# Altium project MB1035.PrjPCB
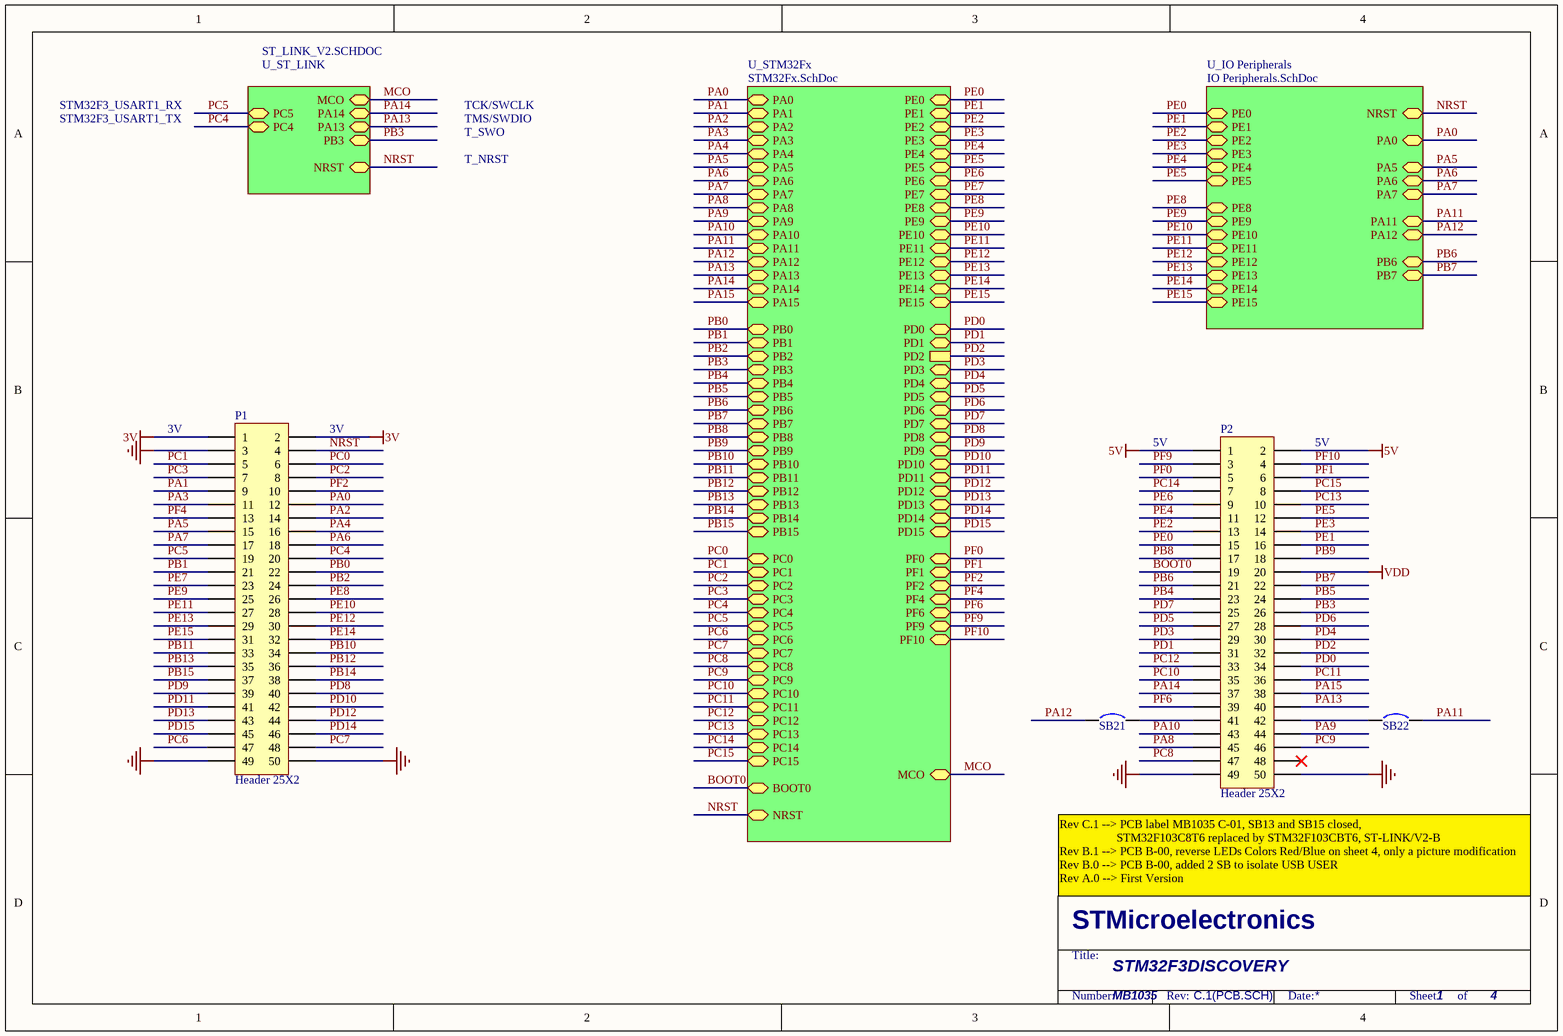
[diagram p0: MB1035.SchDoc]
4 sheets, 145 parts. Net scope: hierarchical (ports join the sheet entries above them; power ports are global).
Sheets:
  MB1035.SchDoc
    U_ST_LINK = ST_LINK_V2.SCHDOC
    U_IO Peripherals = IO Peripherals.SchDoc
    U_STM32Fx = STM32Fx.SchDoc

## Sheet MB1035.SchDoc
size A4; DocumentNumber: 1; Revision: C.1(PCB.SCH); SheetNumber: 1; SheetTotal: 4; PageSetup: Record=PageOptions|CenterHorizontal=True|CenterVertical=True|PrintScale=1.00|XCorrection=1.00|YCorrection=1.00|PrintKind=1|BorderSize=5000000|LeftOffset=0|BottomOffset=0|Orientation=2|PaperLength=1000|PaperWidth=1000|Scale=100|PaperSource=15|PrintQuality=1200|MediaType=1|DitherType=10|PaperKind=A4|PrintScaleMode=1

### Parts
P1  Header 25X2  [HEAD25X2/2.54]
P2  Header 25X2  [HEAD25X2/2.54]
SB21  Circuit Breaker  [JP2_SMD]  (value not drawn)
SB22  Circuit Breaker  [JP2_SMD]  (value not drawn)

### Sub-sheets
U_IO Peripherals = IO Peripherals.SchDoc: PA0, NRST, PE0, PE1, PE3, PA5, PA7, PA6, PB6, PB7, PE4, PE5, PE2, PE8, PE15, PA11, PA12, PE9, PE10, PE11, PE12, PE13, PE14
U_ST_LINK = ST_LINK_V2.SCHDOC: PA13, PA14, NRST, PC5, PC4, PB3, MCO
U_STM32Fx = STM32Fx.SchDoc: PB8, PC5, PC4, PD2, BOOT0, NRST, PE0, PE1, PE2, PE3, PE4, PE5, PE6, PE7, PE8, PE9, PE10, PE11, PE12, PE13, PE14, PE15, PD0, PD1, PD3, PD4, PD5, PD6, PD7, PD8, PD9, PD10, PD11, PD12, PD13, PD14, PD15, PC15, PC14, PF1, PF0, MCO, PF2, PF4, PF6, PF9, PF10, PC0, PC1, PC2, PC3, PC6, PC7, PC8, PC9, PC10, PC11, PC12, PC13, PA0, PA1, PA2, PA3, PA4, PA5, PA6, PA7, PA8, PA9, PA10, PA11, PA12, PA13, PA14, PA15, PB0, PB1, PB2, PB3, PB4, PB5, PB6, PB7, PB9, PB10, PB11, PB12, PB13, PB14, PB15

### Nets
3V: P1.1 P1.2
5V: P2.1 P2.2
GND: P1.3 P1.49 P1.50 P2.49 P2.50
VDD: P2.20
BOOT0: P2.19 ; sheet U_STM32Fx/BOOT0
MCO: sheet U_ST_LINK/MCO, sheet U_STM32Fx/MCO
NRST: P1.4 ; sheet U_ST_LINK/NRST, sheet U_IO Peripherals/NRST, sheet U_STM32Fx/NRST
PA0: P1.12 ; sheet U_IO Peripherals/PA0, sheet U_STM32Fx/PA0
PA1: P1.9 ; sheet U_STM32Fx/PA1
PA2: P1.14 ; sheet U_STM32Fx/PA2
PA3: P1.11 ; sheet U_STM32Fx/PA3
PA4: P1.16 ; sheet U_STM32Fx/PA4
PA5: P1.15 ; sheet U_IO Peripherals/PA5, sheet U_STM32Fx/PA5
PA6: P1.18 ; sheet U_IO Peripherals/PA6, sheet U_STM32Fx/PA6
PA7: P1.17 ; sheet U_IO Peripherals/PA7, sheet U_STM32Fx/PA7
PA8: P2.45 ; sheet U_STM32Fx/PA8
PA9: P2.44 ; sheet U_STM32Fx/PA9
PA10: P2.43 ; sheet U_STM32Fx/PA10
PA11: SB22.2 ; sheet U_IO Peripherals/PA11, sheet U_STM32Fx/PA11
PA12: SB21.1 ; sheet U_IO Peripherals/PA12, sheet U_STM32Fx/PA12
PA13: P2.40 ; sheet U_ST_LINK/PA13, sheet U_STM32Fx/PA13
PA14: P2.37 ; sheet U_ST_LINK/PA14, sheet U_STM32Fx/PA14
PA15: P2.38 ; sheet U_STM32Fx/PA15
PB0: P1.22 ; sheet U_STM32Fx/PB0
PB1: P1.21 ; sheet U_STM32Fx/PB1
PB2: P1.24 ; sheet U_STM32Fx/PB2
PB3: P2.26 ; sheet U_ST_LINK/PB3, sheet U_STM32Fx/PB3
PB4: P2.23 ; sheet U_STM32Fx/PB4
PB5: P2.24 ; sheet U_STM32Fx/PB5
PB6: P2.21 ; sheet U_IO Peripherals/PB6, sheet U_STM32Fx/PB6
PB7: P2.22 ; sheet U_IO Peripherals/PB7, sheet U_STM32Fx/PB7
PB8: P2.17 ; sheet U_STM32Fx/PB8
PB9: P2.18 ; sheet U_STM32Fx/PB9
PB10: P1.34 ; sheet U_STM32Fx/PB10
PB11: P1.33 ; sheet U_STM32Fx/PB11
PB12: P1.36 ; sheet U_STM32Fx/PB12
PB13: P1.35 ; sheet U_STM32Fx/PB13
PB14: P1.38 ; sheet U_STM32Fx/PB14
PB15: P1.37 ; sheet U_STM32Fx/PB15
PC0: P1.6 ; sheet U_STM32Fx/PC0
PC1: P1.5 ; sheet U_STM32Fx/PC1
PC2: P1.8 ; sheet U_STM32Fx/PC2
PC3: P1.7 ; sheet U_STM32Fx/PC3
PC4: P1.20 ; sheet U_ST_LINK/PC4, sheet U_STM32Fx/PC4
PC5: P1.19 ; sheet U_ST_LINK/PC5, sheet U_STM32Fx/PC5
PC6: P1.47 ; sheet U_STM32Fx/PC6
PC7: P1.48 ; sheet U_STM32Fx/PC7
PC8: P2.47 ; sheet U_STM32Fx/PC8
PC9: P2.46 ; sheet U_STM32Fx/PC9
PC10: P2.35 ; sheet U_STM32Fx/PC10
PC11: P2.36 ; sheet U_STM32Fx/PC11
PC12: P2.33 ; sheet U_STM32Fx/PC12
PC13: P2.10 ; sheet U_STM32Fx/PC13
PC14: P2.7 ; sheet U_STM32Fx/PC14
PC15: P2.8 ; sheet U_STM32Fx/PC15
PD0: P2.34 ; sheet U_STM32Fx/PD0
PD1: P2.31 ; sheet U_STM32Fx/PD1
PD2: P2.32 ; sheet U_STM32Fx/PD2
PD3: P2.29 ; sheet U_STM32Fx/PD3
PD4: P2.30 ; sheet U_STM32Fx/PD4
PD5: P2.27 ; sheet U_STM32Fx/PD5
PD6: P2.28 ; sheet U_STM32Fx/PD6
PD7: P2.25 ; sheet U_STM32Fx/PD7
PD8: P1.40 ; sheet U_STM32Fx/PD8
PD9: P1.39 ; sheet U_STM32Fx/PD9
PD10: P1.42 ; sheet U_STM32Fx/PD10
PD11: P1.41 ; sheet U_STM32Fx/PD11
PD12: P1.44 ; sheet U_STM32Fx/PD12
PD13: P1.43 ; sheet U_STM32Fx/PD13
PD14: P1.46 ; sheet U_STM32Fx/PD14
PD15: P1.45 ; sheet U_STM32Fx/PD15
PE0: P2.15 ; sheet U_IO Peripherals/PE0, sheet U_STM32Fx/PE0
PE1: P2.16 ; sheet U_IO Peripherals/PE1, sheet U_STM32Fx/PE1
PE2: P2.13 ; sheet U_IO Peripherals/PE2, sheet U_STM32Fx/PE2
PE3: P2.14 ; sheet U_IO Peripherals/PE3, sheet U_STM32Fx/PE3
PE4: P2.11 ; sheet U_IO Peripherals/PE4, sheet U_STM32Fx/PE4
PE5: P2.12 ; sheet U_IO Peripherals/PE5, sheet U_STM32Fx/PE5
PE6: P2.9 ; sheet U_STM32Fx/PE6
PE7: P1.23 ; sheet U_STM32Fx/PE7
PE8: P1.26 ; sheet U_IO Peripherals/PE8, sheet U_STM32Fx/PE8
PE9: P1.25 ; sheet U_IO Peripherals/PE9, sheet U_STM32Fx/PE9
PE10: P1.28 ; sheet U_IO Peripherals/PE10, sheet U_STM32Fx/PE10
PE11: P1.27 ; sheet U_IO Peripherals/PE11, sheet U_STM32Fx/PE11
PE12: P1.30 ; sheet U_IO Peripherals/PE12, sheet U_STM32Fx/PE12
PE13: P1.29 ; sheet U_IO Peripherals/PE13, sheet U_STM32Fx/PE13
PE14: P1.32 ; sheet U_IO Peripherals/PE14, sheet U_STM32Fx/PE14
PE15: P1.31 ; sheet U_IO Peripherals/PE15, sheet U_STM32Fx/PE15
PF0: P2.5 ; sheet U_STM32Fx/PF0
PF1: P2.6 ; sheet U_STM32Fx/PF1
PF2: P1.10 ; sheet U_STM32Fx/PF2
PF4: P1.13 ; sheet U_STM32Fx/PF4
PF6: P2.39 ; sheet U_STM32Fx/PF6
PF9: P2.3 ; sheet U_STM32Fx/PF9
PF10: P2.4 ; sheet U_STM32Fx/PF10
NetP2_41: P2.41 SB21.2
NetP2_42: P2.42 SB22.1

Not connected (* = marked no-connect by the designer): P2 48*

### Notes on the sheet
- STM32F3_USART1_RX
- TCK/SWCLK
- STM32F3_USART1_TX
- TMS/SWDIO
- T_SWO
- T_NRST
- 3V
- (near P1) 3V
- 5V
- (near P2) 5V
- (near P2) Rev C.1 --> PCB label MB1035 C-01, SB13 and SB15 closed,
  STM32F103C8T6 replaced by STM32F103CBT6, ST-LINK/V2-B
  Rev B.1 --> PCB B-00, reverse LEDs Colors Red/Blue on sheet 4, only a picture modification
  Rev B.0 --> PCB B-00, added 2 SB to isolate USB USER
  Rev A.0 --> First Version
- STM32F3DISCOVERY
- MB1035
- 1
- STMicroelectronics
- Title:
- Number:
- Rev:
- Date:
- Sheet       of

### Library data of the parts
P1 P2 = Header 25X2: Header, 25-Pin, Dual row; LatestRevisionDate: 17-Jul-2002; LatestRevisionNote: Re-released for DXP Platform.; Publisher: Altium Limited
SB21 SB22 = Circuit Breaker: Solder: NO; Published: 24-Mar-1999; Revision: July-2002: Re-released for DXP Platform.; Publisher: Altium Limited

## Sheet ST_LINK_V2.SCHDOC
size A4; DocumentNumber: 2; Revision: C.1(PCB.SCH); SheetNumber: 2; SheetTotal: 4
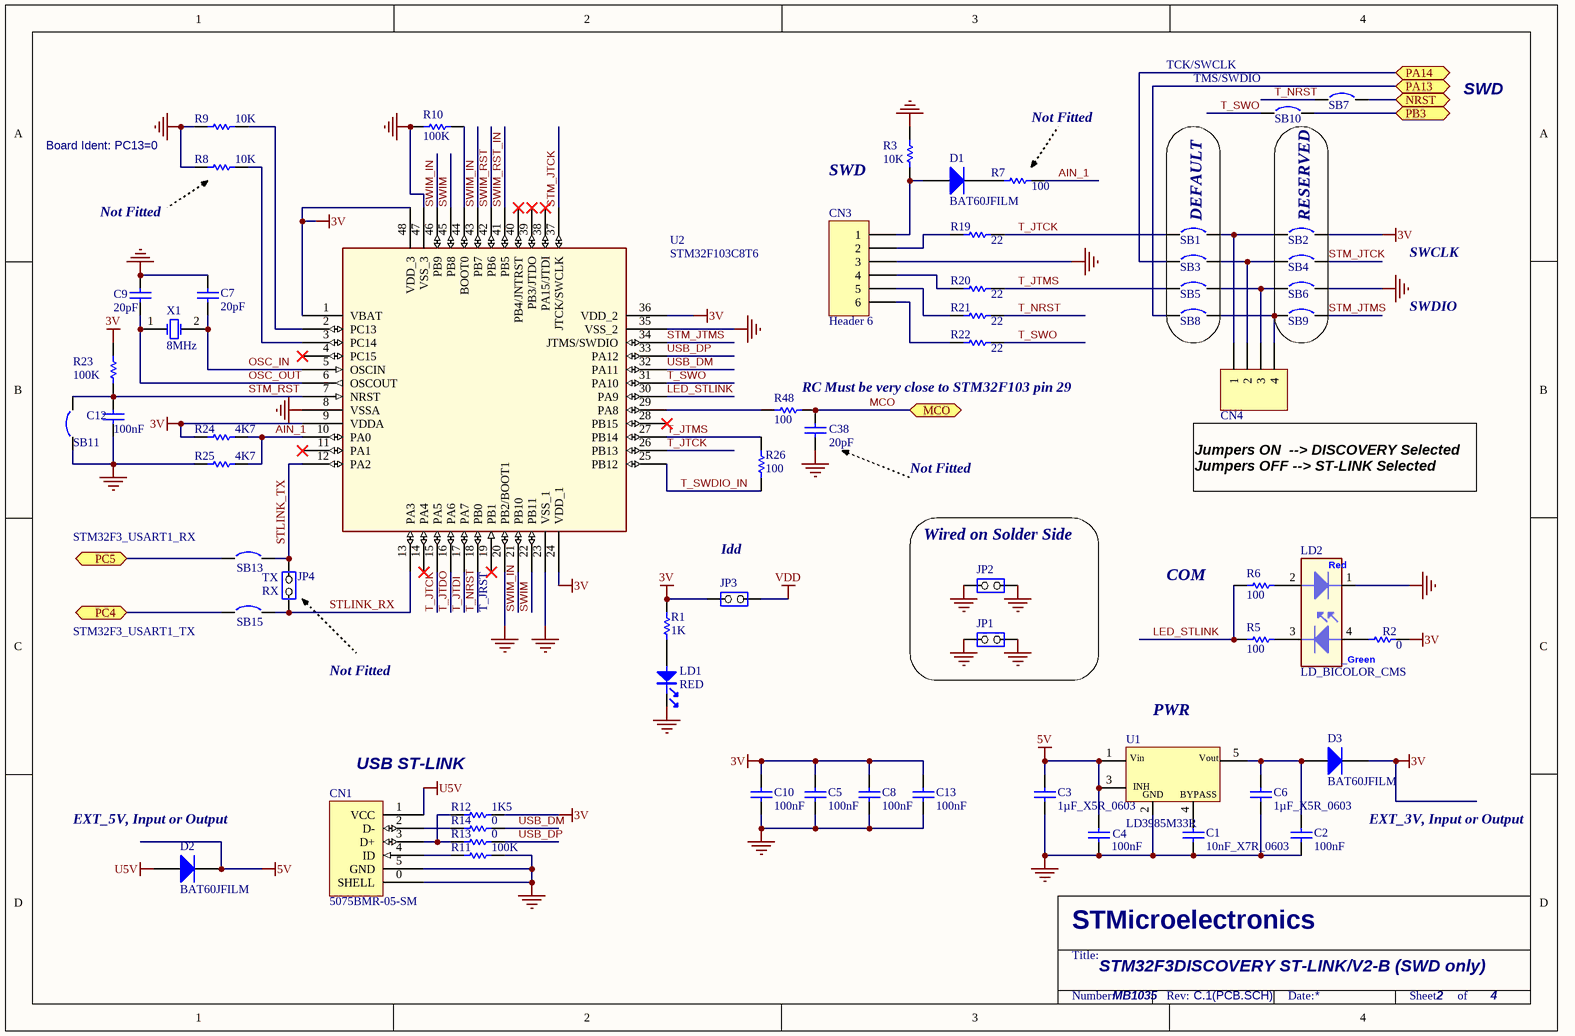
[diagram p1: ST_LINK_V2.SCHDOC]

### Parts
C1  10nF_X7R_0603  [0603C]
C2  100nF  [0603C]
C3  1µF_X5R_0603  [0603C]
C4  100nF  [0603C]
C5  100nF  [0402C]
C6  1µF_X5R_0603  [0603C]
C7  20pF  [0402C]
C8  100nF  [0402C]
C9  20pF  [0402C]
C10  100nF  [0402C]
C12  100nF  [0402C]
C13  100nF  [0402C]
C38  20pF  [0402C]
CN1  5075BMR-05-SM  [USB-MINI-B-SMD]
CN3  Header 6  [HDR1X6]
CN4  Header 4  [Header 4]  (value not drawn)
D1  BAT60JFILM  [SOD323/A]
D2  BAT60JFILM  [SOD323/A]
D3  BAT60JFILM  [SOD323/A]
JP1  (no value)  [SIP2/2.54]
JP2  (no value)  [SIP2/2.54]
JP3  (no value)  [SIP2/2.54]
JP4  JP2  [SIP2/2.54]  (value not drawn)
LD1  RED  [0603D]
LD2  LD_BICOLOR_CMS  [HSMF-A201]
R1  1K  [0402R]
R2  0  [0402R]
R3  10K  [0402R]
R5  100  [0402R]
R6  100  [0402R]
R7  100  [0402R]
R8  10K  [0402R]
R9  10K  [0402R]
R10  100K  [0402R]
R11  100K  [0402R]
R12  1K5  [0402R]
R13  0  [0402R]
R14  0  [0402R]
R19  22  [0402R]
R20  22  [0402R]
R21  22  [0402R]
R22  22  [0402R]
R23  100K  [0402R]
R24  4K7  [0402R]
R25  4K7  [0402R]
R26  100  [0402R]
R48  100  [0402R]
SB1  Circuit Breaker  [JP2_SMD]  (value not drawn)
SB2  Circuit Breaker  [JP2_SMD]  (value not drawn)
SB3  Circuit Breaker  [JP2_SMD]  (value not drawn)
SB4  Circuit Breaker  [JP2_SMD]  (value not drawn)
SB5  Circuit Breaker  [JP2_SMD]  (value not drawn)
SB6  Circuit Breaker  [JP2_SMD]  (value not drawn)
SB7  Circuit Breaker  [JP2_SMD]  (value not drawn)
SB8  Circuit Breaker  [JP2_SMD]  (value not drawn)
SB9  Circuit Breaker  [JP2_SMD]  (value not drawn)
SB10  Circuit Breaker  [JP2_SMD]  (value not drawn)
SB11  Circuit Breaker  [JP2_SMD]  (value not drawn)
SB13  Circuit Breaker  [JP2_SMD]  (value not drawn)
SB15  Circuit Breaker  [JP2_SMD]  (value not drawn)
U1  LD3985M33R  [SOT-23-5L]
U2  STM32F103C8T6  [QFP48 7X7]
X1  8MHz  [XTAL1]

### Blocks framed on the sheet
DEFAULT: SB1 SB3 SB5 SB8
RESERVED: SB2 SB4 SB6 SB9
Wired on Solder Side: JP1 JP2

### Ports
MCO, NRST, PA13, PA14, PB3, PC4, PC5

### Nets
3V: C5.2 C8.1 C10.2 C13.2 D3.2(K) JP3.1(COMMON) R1.2 R2.2 R12.2 R23.2 R24.1 SB2.2 U2.1(VBAT) U2.9(VDDA) U2.24(VDD_1) U2.36(VDD_2) U2.48(VDD_3)
5V: C3.2 C4.2 D2.2(K) U1.1(Vin) U1.3(CE)
GND: C1.1 C2.1 C3.1 C4.1 C5.1 C6.2 C7.1 C8.2 C9.1 C10.1 C12.1 C13.1 C38.2 CN1.0(SHELL) CN1.5(GND) CN3.3 JP1.1(COMMON) JP1.2(NO) JP2.1(COMMON) JP2.2(NO) LD1.2 LD2.1 R3.2 R8.1 R9.1 R10.1 R11.2 R25.1 SB6.2 SB11.1 U1.2(GND) U2.8(VSSA) U2.20(PB2/BOOT1) U2.23(VSS_1) U2.35(VSS_2) U2.47(VSS_3)
U5V: CN1.1(VCC) D2.1(A)
VDD: JP3.2(NO)
AIN_1: R7.2 R24.2 R25.2 U2.10(PA0)
LED_STLINK: R5.1 R6.1 U2.30(PA9)
MCO: C38.1 R48.2 ; port MCO
NRST: SB7.2 ; port NRST
OSC_IN: C7.2 U2.5(OSCIN) X1.2(OSC2)
OSC_OUT: C9.2 U2.6(OSCOUT) X1.1(OSC1)
PA13: SB8.1 ; port PA13
PA14: SB3.1 ; port PA14
PB3: SB10.2 ; port PB3
PC4: SB15.1 ; port PC4
PC5: SB13.1 ; port PC5
STLINK_RX: JP4.1(COMMON) SB15.2 U2.13(PA3)
STLINK_TX: JP4.2(NO) SB13.2 U2.12(PA2)
STM_JTCK: SB4.2 U2.37(JTCK/SWCLK)
STM_JTMS: SB9.2 U2.34(JTMS/SWDIO)
STM_RST: C12.2 R23.1 SB11.2 U2.7(NRST)
SWIM: U2.22(PB11) U2.45(PB8)
SWIM_IN: U2.21(PB10) U2.43(PB7) U2.46(PB9)
SWIM_RST: U2.42(PB6)
SWIM_RST_IN: U2.41(PB5)
T_JTCK: R19.2 SB1.1 U2.15(PA5) U2.26(PB13)
T_JTDI: U2.17(PA7)
T_JTDO: U2.16(PA6)
T_JTMS: R20.2 R26.2 SB5.1 U2.27(PB14)
T_NRST: R21.2 SB7.1 U2.18(PB0)
T_SWDIO_IN: R26.1 U2.25(PB12)
T_SWO: R22.2 SB10.1 U2.31(PA10)
USB_DM: R14.2 U2.32(PA11)
USB_DP: R13.2 U2.33(PA12)
NetC1_2: C1.2 U1.4(BYPASS)
NetC2_2: C2.2 C6.1 D3.1(A) U1.5(Vout)
NetCN1_2: CN1.2(D-) R14.1
NetCN1_3: CN1.3(D+) R12.1 R13.1
NetCN1_4: CN1.4(ID) R11.1
NetCN3_1: CN3.1 D1.1(A) R3.1
NetCN3_2: CN3.2 R19.1
NetCN3_4: CN3.4 R20.1
NetCN3_5: CN3.5 R21.1
NetCN3_6: CN3.6 R22.1
NetCN4_1: CN4.1 SB1.2 SB2.1
NetCN4_2: CN4.2 SB3.2 SB4.1
NetCN4_3: CN4.3 SB5.2 SB6.1
NetCN4_4: CN4.4 SB8.2 SB9.1
NetD1_2: D1.2(K) R7.1
NetLD1_1: LD1.1 R1.1
NetLD2_2: LD2.2 R6.2
NetLD2_3: LD2.3 R5.2
NetLD2_4: LD2.4 R2.1
NetR8_2: R8.2 U2.3(PC14)
NetR9_2: R9.2 U2.2(PC13)
NetR10_2: R10.2 U2.44(BOOT0)
NetR48_1: R48.1 U2.29(PA8)

Not connected (* = marked no-connect by the designer): U2 4(PC15)* 11(PA1)* 14(PA4)* 19(PB1)* 28(PB15)* 38(PA15/JTDI)* 39(PB3/JTDO)* 40(PB4/JNTRST)*

### Notes on the sheet
- TCK/SWCLK
- (near SB10) TMS/SWDIO
- SWD
- Board Ident: PC13=0
- Not Fitted
- SWCLK
- SWDIO
- (near R48) RC Must be very close to STM32F103 pin 29
- Jumpers ON  --> DISCOVERY Selected
  Jumpers OFF --> ST-LINK Selected
- STM32F3_USART1_RX
- TX
- (near JP3) Idd
- COM
- STM32F3_USART1_TX
- RX
- (near U2) T_JRST
- (near U1) PWR
- USB ST-LINK
- (near D2) EXT_5V, Input or Output
- EXT_3V, Input or Output
- STM32F3DISCOVERY ST-LINK/V2-B (SWD only)
- MB1035
- STMicroelectronics
- Title:
- Number:
- Rev:
- Date:
- Sheet       of
- (in symbol LD3985M33R) INH
- (in symbol LD_BICOLOR_CMS) Red; _Green

### Library data of the parts
C1 = CAP SMD 0603  X7R 10000PF 50V 10%: 0603  X7R 10NF; Order code RS: 2040779; Rated voltage: 50V; Tolerance: 10%; Order code Farnell: 7569548RL; Value: 10NF; Power: *; Technology: X7R; Temperature Factor: *; Temperature Min: -55°C; Temperature Max: +125°C; STS Code: *
C2 C4 C5 C7-C10 C12 C13 = Cap: Capacitor; Published: 8-Jun-2000; Revision: July-2002: Re-released for DXP Platform.; Publisher: Altium Limited
  C2 C4 C5 C8 C10 C12 C13: Value: 100nF
  C7 C9: Value: 20pF
C3 C6 = CAP SMD 0603  X5R 1µF 25V 10%: 0603  X5R 1µF; Rated voltage: 25V; Tolerance: 10%; Manufacturer: *; Manufacturer P/N: *; Order code Farnell: 1288202RL; Value: 1µF; Power: *; Technology: X5R; Temperature  Factor: *; Temperature Max: +125°C; Temperature Min: -55°C; STS Code: *
C38 = Cap: Capacitor; Fitted: NO; Published: 8-Jun-2000; Publisher: Altium Limited; Value: 20pF; Revision: July-2002: Re-released for DXP Platform.
CN1 = USB-MINI-typeB connector
CN3 = Header 6: Header, 6-Pin; LatestRevisionDate: 17-Jul-2002; LatestRevisionNote: Re-released for DXP Platform.; Publisher: Altium Limited
CN4 = Header 4: Header, 4-Pin; Revision: 17-Jul-2002: Re-released for DXP Platform.; Publisher: Altium Limited
D1-D3 = BAT60JFILM: Manuf_1: STM; Code - JEDEC: DO-214-AB; Provided: ST; Published: 8-Jun-2000; Revision: July-2002: Re-released for DXP Platform.; Publisher: Altium Limited; Order: BAT60JFILM; Manuf_Part_1: BAT60JFILM
JP1-JP3 = JP2
JP4 = JP2: Fitted: NO
LD1 = PHOTO
LD2 = LD_BICOLOR_CMS: Bicolor Led; Manuf_Part_1: HSMF-A201-A00J1; Manuf_1: Avago Technologies; Ref St: xxxxxx; cap_dec: ----; Distrib: RADIOSPARES; support: ----
R1-R3 R5 R6 R9-R12 R19-R26 R48 = res1: Resistor; Published: 8-Jun-2000; Revision: July-2002: Re-released for DXP Platform.; Publisher: Altium Limited
  R1: Value: 1K
  R2: Value: 0
  R3 R9: Value: 10K
  R5 R6 R26 R48: Value: 100
  R10 R11 R23: Value: 100K
  R12: Value: 1K5
  R19-R22: Value: 22
  R24 R25: Value: 4K7
R7 R8 = res1: Resistor; Fitted: NO; Published: 8-Jun-2000; Revision: July-2002: Re-released for DXP Platform.; Publisher: Altium Limited
  R7: Value: 100
  R8: Value: 10K
R13 R14 = res1: Resistor; Value: 1K5; Published: 8-Jun-2000; Revision: July-2002: Re-released for DXP Platform.; Publisher: Altium Limited
SB1 SB3 SB5 SB8 SB10 SB11 = Circuit Breaker: Solder: NO; Published: 24-Mar-1999; Revision: July-2002: Re-released for DXP Platform.; Publisher: Altium Limited
SB2 SB4 SB6 SB7 SB9 = Circuit Breaker: Solder: YES; Published: 24-Mar-1999; Revision: July-2002: Re-released for DXP Platform.; Publisher: Altium Limited
U1 = LD3985M33R: Ultra low drop-low noise BiCMOS voltage, regulators low ESR capacitors compatible; Manuf_1: STM; Provided: ST; Ref St: 9176161; Manuf_Part_1: LD3985M33R; Distrib: ST; Order: LD3985M33R
U2 = STM32F103C8T6: Medium-density performance line ARM-based 32-bit MCU with 64KB Flash; Manuf_1: STM; Ref St: 9175981; Provided: ST; Manuf_Part_1: STM32F103C8T6; Distrib: ST; Order: STM32F103C8T6
X1 = XTAL: Crystal Oscillator; Published: 8-Jun-2000; LatestRevisionDate: 17-Jul-2002; LatestRevisionNote: Re-released for DXP Platform.; PackageReference: R38; Publisher: Altium Limited
SB13 SB15 = Circuit Breaker: Published: 24-Mar-1999; Revision: July-2002: Re-released for DXP Platform.; Publisher: Altium Limited

## Sheet IO Peripherals.SchDoc
size A4; DocumentNumber: 6; Revision: C.1(PCB.SCH); SheetNumber: 4; SheetTotal: 4
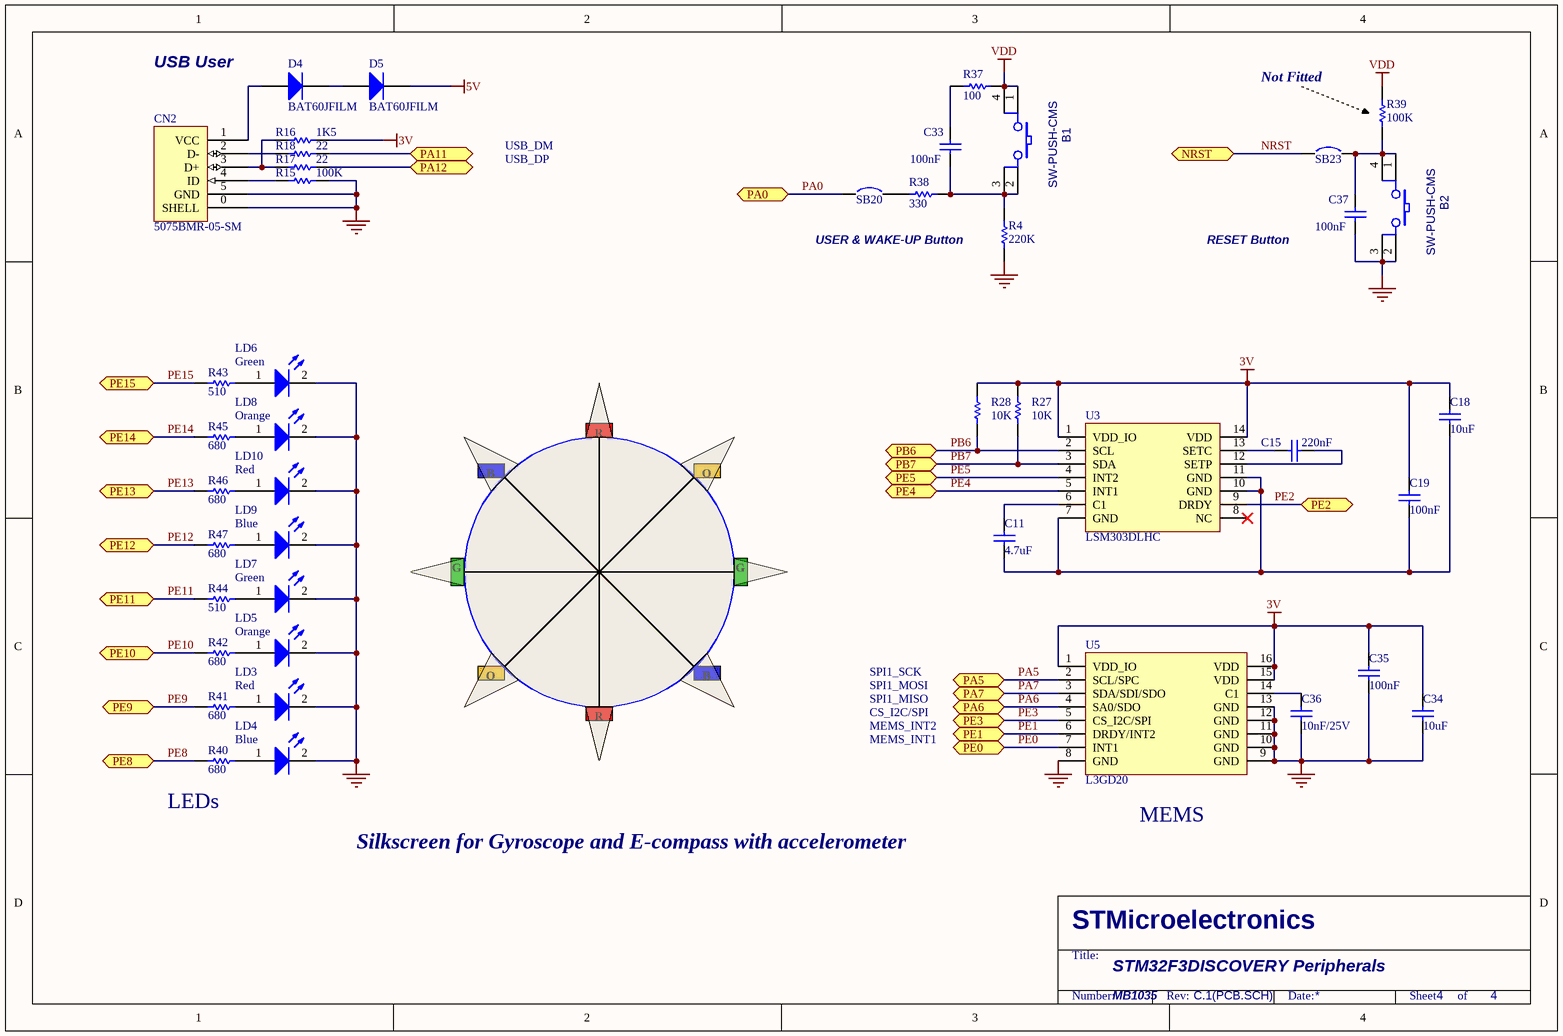
[diagram p2: IO Peripherals.SchDoc]

### Parts
B1  SW-PUSH-CMS  [BP1CMS]
B2  SW-PUSH-CMS  [BP1CMS]
C11  4.7uF  [0603C]
C15  220nF  [0603C]
C18  10uF  [0603C]
C19  100nF  [0603C]
C33  100nF  [0603C]
C34  10uF  [0603C]
C35  100nF  [0603C]
C36  10nF/25V  [0603C]
C37  100nF  [0603C]
CN2  5075BMR-05-SM  [USB-MINI-B-SMD]
D4  BAT60JFILM  [SOD323/A]
D5  BAT60JFILM  [SOD323/A]
LD3  Red  [0603D]
LD4  Blue  [0603D]
LD5  Orange  [0603D]
LD6  Green  [0603D]
LD7  Green  [0603D]
LD8  Orange  [0603D]
LD9  Blue  [0603D]
LD10  Red  [0603D]
R4  220K  [0603R]
R15  100K  [0402R]
R16  1K5  [0402R]
R17  22  [0402R]
R18  22  [0402R]
R27  10K  [0402R]
R28  10K  [0402R]
R37  100  [0402R]
R38  330  [0402R]
R39  100K  [0402R]
R40  680  [0603R]
R41  680  [0603R]
R42  680  [0603R]
R43  510  [0603R]
R44  510  [0603R]
R45  680  [0603R]
R46  680  [0603R]
R47  680  [0603R]
SB20  Circuit Breaker  [JP2_SMD]  (value not drawn)
SB23  Circuit Breaker  [JP2_SMD]  (value not drawn)
U3  LSM303DLHC  [LGA14]
U5  L3GD20  [LGA16]

### Ports
NRST, PA0, PA5, PA6, PA7, PA11, PA12, PB6, PB7, PE0, PE1, PE2, PE3, PE4, PE5, PE8, PE9, PE10, PE11, PE12, PE13, PE14, PE15

### Nets
3V: C18.2 C19.2 C34.2 C35.2 R16.2 R27.1 R28.1 U3.1(VDD_IO) U3.14(VDD) U5.1(VDD_IO) U5.15(VDD) U5.16(VDD)
5V: D5.2(K)
GND: B2.2 B2.3 C34.1 C35.1 C36.1 C37.1 CN2.0(SHELL) CN2.5(GND) LD3.2(K) LD4.2(K) LD5.2(K) LD6.2(K) LD7.2(K) LD8.2(K) LD9.2(K) LD10.2(K) R4.1 R15.2 U5.8(GND) U5.9(GND) U5.10(GND) U5.11(GND) U5.12(GND) U5.13(GND)
VDD: B1.1 B1.4 R37.2 R39.2
NRST: SB23.1 ; port NRST
PA0: SB20.1 ; port PA0
PA5: U5.2(SCL/SPC) ; port PA5
PA6: U5.4(SA0/SDO) ; port PA6
PA7: U5.3(SDA/SDI/SDO) ; port PA7
PA11: R18.2 ; port PA11
PA12: R17.2 ; port PA12
PB6: R28.2 U3.2(SCL) ; port PB6
PB7: R27.2 U3.3(SDA) ; port PB7
PE0: U5.7(INT1) ; port PE0
PE1: U5.6(DRDY/INT2) ; port PE1
PE2: U3.9(DRDY) ; port PE2
PE3: U5.5(CS_I2C/SPI) ; port PE3
PE4: U3.5(INT1) ; port PE4
PE5: U3.4(INT2) ; port PE5
PE8: R40.2 ; port PE8
PE9: R41.2 ; port PE9
PE10: R42.2 ; port PE10
PE11: R44.2 ; port PE11
PE12: R47.2 ; port PE12
PE13: R46.2 ; port PE13
PE14: R45.2 ; port PE14
PE15: R43.2 ; port PE15
NetB1_2: B1.2 B1.3 C33.1 R4.2 R38.2
NetB2_1: B2.1 B2.4 C37.2 R39.1 SB23.2
NetC11_1: C11.1 C18.1 C19.1 U3.7(GND) U3.10(GND) U3.11(GND)
NetC11_2: C11.2 U3.6(C1)
NetC15_1: C15.1 U3.13(SETC)
NetC15_2: C15.2 U3.12(SETP)
NetC33_2: C33.2 R37.1
NetC36_2: C36.2 U5.14(C1)
NetCN2_1: CN2.1(VCC) D4.1(A)
NetCN2_2: CN2.2(D-) R18.1
NetCN2_3: CN2.3(D+) R16.1 R17.1
NetCN2_4: CN2.4(ID) R15.1
NetD4_2: D4.2(K) D5.1(A)
NetLD3_1: LD3.1(A) R41.1
NetLD4_1: LD4.1(A) R40.1
NetLD5_1: LD5.1(A) R42.1
NetLD6_1: LD6.1(A) R43.1
NetLD7_1: LD7.1(A) R44.1
NetLD8_1: LD8.1(A) R45.1
NetLD9_1: LD9.1(A) R47.1
NetLD10_1: LD10.1(A) R46.1
NetR38_1: R38.1 SB20.2

Not connected (* = marked no-connect by the designer): U3 8(NC)*

### Notes on the sheet
- USB User
- Not Fitted
- USB_DM
- USB_DP
- USER & WAKE-UP Button
- RESET Button
- N
- R
- B
- O
- W
- G
- E
- SPI1_MOSI
- SPI1_SCK
- SPI1_MISO
- CS_I2C/SPI
- S
- MEMS_INT1
- MEMS_INT2
- (near R40) LEDs
- Silkscreen for Gyroscope and E-compass with accelerometer
- (near U5) MEMS
- STM32F3DISCOVERY Peripherals
- MB1035
- STMicroelectronics
- Title:
- Number:
- Rev:
- Date:
- Sheet       of

### Library data of the parts
B1 B2 = SW-PUSH-CMS: Non-Open Push-Button 0.1A 24V; Manuf_1: FARNELL; Manuf_Part_1: 535-930; Ref St: 9180120; cap_dec: ---
C11 C15 C18 C34 C36 = CAP: Capacitor; Value: 100nF; Published: 8-Jun-2000; Revision: July-2002: Re-released for DXP Platform.; Publisher: Altium Limited
C19 C33 C35 C37 = CAP: Capacitor; Published: 8-Jun-2000; Revision: July-2002: Re-released for DXP Platform.; Publisher: Altium Limited; Value: 100nF
CN2 = USB-MINI-typeB connector
D4 D5 = BAT60JFILM: as D1 on sheet ST_LINK_V2; Published: 8-Jun-2000; Revision: July-2002: Re-released for DXP Platform.; Publisher: Altium Limited; Order: BAT60JFILM; Manuf_Part_1: BAT60JFILM
LD3-LD10 = LED2: Typical RED, GREEN, YELLOW, AMBER GaAs LED; Published: 8-Jun-2000; Revision: July-2002: Re-released for DXP Platform.; Publisher: Altium Limited
R4 = res1: Resistor; Value: 10K; Published: 8-Jun-2000; Revision: July-2002: Re-released for DXP Platform.; Publisher: Altium Limited
R15 R16 R27 R28 R38 = res1: Resistor; Published: 8-Jun-2000; Revision: July-2002: Re-released for DXP Platform.; Publisher: Altium Limited
  R15: Value: 100K
  R16: Value: 1K5
  R27 R28: Value: 10K
  R38: Value: 330
R17 R18 = res1: Resistor; Value: 1K5; Published: 8-Jun-2000; Revision: July-2002: Re-released for DXP Platform.; Publisher: Altium Limited
R37 = res1: Resistor; Value: 330; Published: 8-Jun-2000; Revision: July-2002: Re-released for DXP Platform.; Publisher: Altium Limited
R39 = res1: Resistor; Fitted: NO; Published: 8-Jun-2000; Revision: July-2002: Re-released for DXP Platform.; Publisher: Altium Limited; Value: 100K
R40-R47 = Res1: Resistor; Value: 1K; Published: 8-Jun-2000; Revision: July-2002: Re-released for DXP Platform.; Publisher: Altium Limited
SB20 SB23 = Circuit Breaker: Solder: YES; Published: 24-Mar-1999; Revision: July-2002: Re-released for DXP Platform.; Publisher: Altium Limited
U3 = LSM303DLHC: Ultra compact high performance e-compass 3D accelerometer and 3D magnetometer module; Manuf_1: STM; Manuf_Part_1: LSM303DLHCTR; Provided: ST; ref St: xxxxxxxxxx; Distrib: ST; Footprint: LGA14(3*5); Order: LSM303DLHCTR
U5 = L3GD20: MEMS motion sensor three-axis digital output gyroscopeelerometer; Manuf_1: STM; Manuf_Part_1: L3GD20TR; Provided: ST; ref St: xxxxxxxx; Distrib: ST; Footprint: LGA16(4*4); Order: L3GD20TR

## Sheet STM32Fx.SchDoc
size A4; DocumentNumber: 3; Revision: C.1(PCB.SCH); SheetNumber: 3; SheetTotal: 4
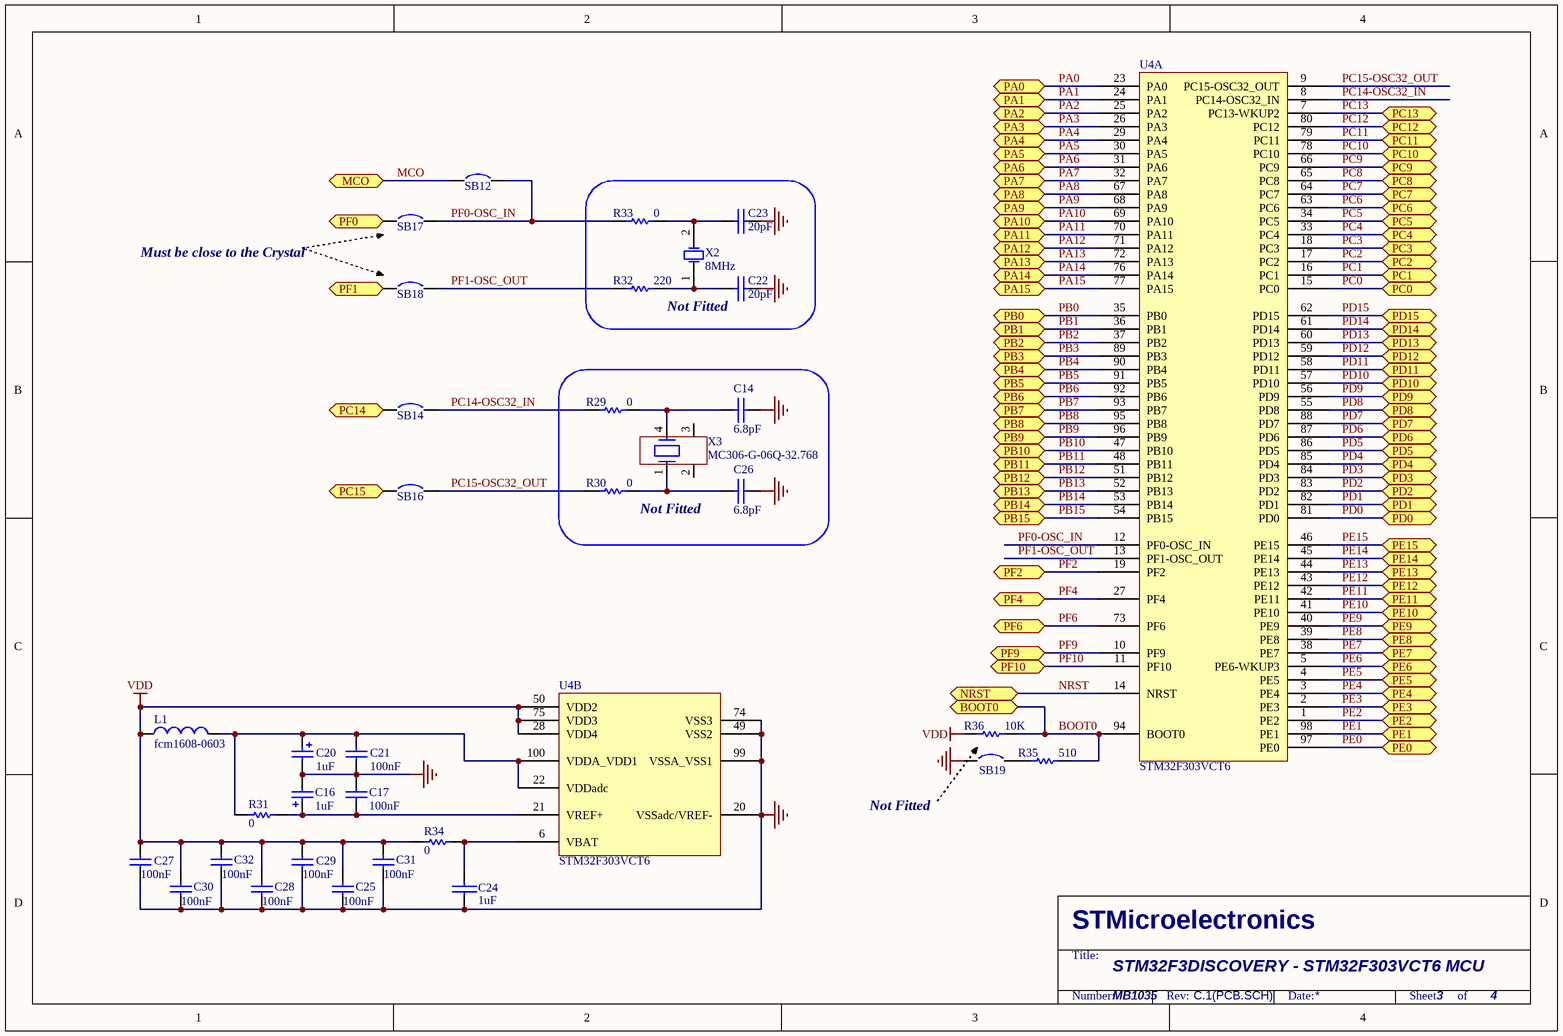
[diagram p3: STM32Fx.SchDoc]

### Parts
C14  6.8pF  [0603C]
C16  1uF  [CASE-AA]
C17  100nF  [0603C]
C20  1uF  [CASE-AA]
C21  100nF  [0603C]
C22  20pF  [0603C]
C23  20pF  [0603C]
C24  1uF  [0603C]
C25  100nF  [0603C]
C26  6.8pF  [0603C]
C27  100nF  [0603C]
C28  100nF  [0603C]
C29  100nF  [0603C]
C30  100nF  [0603C]
C31  100nF  [0603C]
C32  100nF  [0603C]
L1  fcm1608-0603  [0603L]
R29  0  [0402R]
R30  0  [0402R]
R31  0  [0402R]
R32  220  [0402R]
R33  0  [0402R]
R34  0  [0402R]
R35  510  [0402R]
R36  10K  [0402R]
SB12  Circuit Breaker  [JP2_SMD]  (value not drawn)
SB14  Circuit Breaker  [JP2_SMD]  (value not drawn)
SB16  Circuit Breaker  [JP2_SMD]  (value not drawn)
SB17  Circuit Breaker  [JP2_SMD]  (value not drawn)
SB18  Circuit Breaker  [JP2_SMD]  (value not drawn)
SB19  Circuit Breaker  [JP2_SMD]  (value not drawn)
U4  STM32F303VCT6  [LQFP100]  (parts A,B of 2)
X2  8MHz  [XTAL1]
X3  MC306-G-06Q-32.768  [MC306-CRYSTAL]

### Blocks framed on the sheet
Not Fitted: C22 C23 R32 R33 X2
Not Fitted: C14 C26 R29 R30 X3

### Ports
BOOT0, MCO, NRST, PA0, PA1, PA2, PA3, PA4, PA5, PA6, PA7, PA8, PA9, PA10, PA11, PA12, PA13, PA14, PA15, PB0, PB1, PB2, PB3, PB4, PB5, PB6, PB7, PB8, PB9, PB10, PB11, PB12, PB13, PB14, PB15, PC0, PC1, PC2, PC3, PC4, PC5, PC6, PC7, PC8, PC9, PC10, PC11, PC12, PC13, PC14, PC15, PD0, PD1, PD2, PD3, PD4, PD5, PD6, PD7, PD8, PD9, PD10, PD11, PD12, PD13, PD14, PD15, PE0, PE1, PE2, PE3, PE4, PE5, PE6, PE7, PE8, PE9, PE10, PE11, PE12, PE13, PE14, PE15, PF0, PF1, PF2, PF4, PF6, PF9, PF10

### Nets
GND: C14.2 C16.2 C17.1 C20.2 C21.1 C22.1 C23.1 C24.2 C25.1 C26.2 C27.1 C28.1 C29.1 C30.1 C31.2 C32.2 SB19.1 U4.20(VSSadc/VREF-) U4.49(VSS2) U4.74(VSS3) U4.99(VSSA_VSS1)
VDD: C25.2 C27.2 C28.2 C29.2 C30.2 C31.1 C32.1 L1.1 R34.2 R36.1 U4.28(VDD4) U4.50(VDD2) U4.75(VDD3)
BOOT0: R35.2 R36.2 U4.94(BOOT0) ; port BOOT0
MCO: SB12.1 ; port MCO
NRST: U4.14(NRST) ; port NRST
PA0: U4.23(PA0) ; port PA0
PA1: U4.24(PA1) ; port PA1
PA2: U4.25(PA2) ; port PA2
PA3: U4.26(PA3) ; port PA3
PA4: U4.29(PA4) ; port PA4
PA5: U4.30(PA5) ; port PA5
PA6: U4.31(PA6) ; port PA6
PA7: U4.32(PA7) ; port PA7
PA8: U4.67(PA8) ; port PA8
PA9: U4.68(PA9) ; port PA9
PA10: U4.69(PA10) ; port PA10
PA11: U4.70(PA11) ; port PA11
PA12: U4.71(PA12) ; port PA12
PA13: U4.72(PA13) ; port PA13
PA14: U4.76(PA14) ; port PA14
PA15: U4.77(PA15) ; port PA15
PB0: U4.35(PB0) ; port PB0
PB1: U4.36(PB1) ; port PB1
PB2: U4.37(PB2) ; port PB2
PB3: U4.89(PB3) ; port PB3
PB4: U4.90(PB4) ; port PB4
PB5: U4.91(PB5) ; port PB5
PB6: U4.92(PB6) ; port PB6
PB7: U4.93(PB7) ; port PB7
PB8: U4.95(PB8) ; port PB8
PB9: U4.96(PB9) ; port PB9
PB10: U4.47(PB10) ; port PB10
PB11: U4.48(PB11) ; port PB11
PB12: U4.51(PB12) ; port PB12
PB13: U4.52(PB13) ; port PB13
PB14: U4.53(PB14) ; port PB14
PB15: U4.54(PB15) ; port PB15
PC0: U4.15(PC0) ; port PC0
PC1: U4.16(PC1) ; port PC1
PC2: U4.17(PC2) ; port PC2
PC3: U4.18(PC3) ; port PC3
PC4: U4.33(PC4) ; port PC4
PC5: U4.34(PC5) ; port PC5
PC6: U4.63(PC6) ; port PC6
PC7: U4.64(PC7) ; port PC7
PC8: U4.65(PC8) ; port PC8
PC9: U4.66(PC9) ; port PC9
PC10: U4.78(PC10) ; port PC10
PC11: U4.79(PC11) ; port PC11
PC12: U4.80(PC12) ; port PC12
PC13: U4.7(PC13-WKUP2) ; port PC13
PC14: SB14.1 ; port PC14
PC14-OSC32_IN: R29.1 SB14.2 U4.8(PC14-OSC32_IN)
PC15: SB16.1 ; port PC15
PC15-OSC32_OUT: R30.1 SB16.2 U4.9(PC15-OSC32_OUT)
PD0: U4.81(PD0) ; port PD0
PD1: U4.82(PD1) ; port PD1
PD2: U4.83(PD2) ; port PD2
PD3: U4.84(PD3) ; port PD3
PD4: U4.85(PD4) ; port PD4
PD5: U4.86(PD5) ; port PD5
PD6: U4.87(PD6) ; port PD6
PD7: U4.88(PD7) ; port PD7
PD8: U4.55(PD8) ; port PD8
PD9: U4.56(PD9) ; port PD9
PD10: U4.57(PD10) ; port PD10
PD11: U4.58(PD11) ; port PD11
PD12: U4.59(PD12) ; port PD12
PD13: U4.60(PD13) ; port PD13
PD14: U4.61(PD14) ; port PD14
PD15: U4.62(PD15) ; port PD15
PE0: U4.97(PE0) ; port PE0
PE1: U4.98(PE1) ; port PE1
PE2: U4.1(PE2) ; port PE2
PE3: U4.2(PE3) ; port PE3
PE4: U4.3(PE4) ; port PE4
PE5: U4.4(PE5) ; port PE5
PE6: U4.5(PE6-WKUP3) ; port PE6
PE7: U4.38(PE7) ; port PE7
PE8: U4.39(PE8) ; port PE8
PE9: U4.40(PE9) ; port PE9
PE10: U4.41(PE10) ; port PE10
PE11: U4.42(PE11) ; port PE11
PE12: U4.43(PE12) ; port PE12
PE13: U4.44(PE13) ; port PE13
PE14: U4.45(PE14) ; port PE14
PE15: U4.46(PE15) ; port PE15
PF0: SB17.1 ; port PF0
PF0-OSC_IN: R33.1 SB12.2 SB17.2 U4.12(PF0-OSC_IN)
PF1: SB18.1 ; port PF1
PF1-OSC_OUT: R32.1 SB18.2 U4.13(PF1-OSC_OUT)
PF2: U4.19(PF2) ; port PF2
PF4: U4.27(PF4) ; port PF4
PF6: U4.73(PF6) ; port PF6
PF9: U4.10(PF9) ; port PF9
PF10: U4.11(PF10) ; port PF10
NetC14_1: C14.1 R29.2 X3.4
NetC16_1: C16.1 C17.2 R31.1 U4.21(VREF+)
NetC20_1: C20.1 C21.2 L1.2 R31.2 U4.22(VDDadc) U4.100(VDDA_VDD1)
NetC22_2: C22.2 R32.2 X2.1(OSC1)
NetC23_2: C23.2 R33.2 X2.2(OSC2)
NetC24_1: C24.1 R34.1 U4.6(VBAT)
NetC26_1: C26.1 R30.2 X3.1
NetR35_1: R35.1 SB19.2

Not connected (* = marked no-connect by the designer): X3 2 3

### Notes on the sheet
- Must be close to the Crystal
- Not Fitted
- STM32F3DISCOVERY - STM32F303VCT6 MCU
- MB1035
- STMicroelectronics
- Title:
- Number:
- Rev:
- Date:
- Sheet       of

### Library data of the parts
C14 C22 C23 C26 = CAP: Capacitor; Fitted: NO
  C14 C26: Value: 6.8pF
  C22 C23: Value: 20pF
C16 C20 = Cap Pol1: Polarized Capacitor (Radial); Value: 10uF; Published: 8-Jun-2000; Revision: July-2002: Re-released for DXP Platform.; Publisher: Altium Limited
C17 C21 C25 C27-C32 = Cap: Capacitor; Published: 8-Jun-2000; Revision: July-2002: Re-released for DXP Platform.; Publisher: Altium Limited; Value: 100nF
C24 = CAP: Capacitor; Value: 1uF
L1 = Inductor: Value: 100uH; Published: 8-Jun-2000; Revision: July-2002: Re-released for DXP Platform.; Publisher: Altium Limited
R29 R30 R32 R33 = res1: Resistor; Value: 1K5; Fitted: NO; Published: 8-Jun-2000; Revision: July-2002: Re-released for DXP Platform.; Publisher: Altium Limited
R31 R34 = Res1: Resistor; Value: 1K; Published: 8-Jun-2000; Revision: July-2002: Re-released for DXP Platform.; Publisher: Altium Limited
R35 = res1: Resistor; Value: 10K; Published: 8-Jun-2000; Revision: July-2002: Re-released for DXP Platform.; Publisher: Altium Limited
R36 = res1: Resistor; Fitted: NO; Published: 8-Jun-2000; Revision: July-2002: Re-released for DXP Platform.; Publisher: Altium Limited; Value: 10K
SB12 SB14 SB16 SB18 SB19 = Circuit Breaker: Solder: YES; Published: 24-Mar-1999; Revision: July-2002: Re-released for DXP Platform.; Publisher: Altium Limited
SB17 = Circuit Breaker: Solder: NO; Published: 24-Mar-1999; Revision: July-2002: Re-released for DXP Platform.; Publisher: Altium Limited
U4 = STM32F303VCT6: STM32F303VCT6 (Manta-Edge); Manuf_1: STM; Provided: ST; Order: STM32F303VCT6; Manuf_Part_1: STM32F303VCT6; Distrib: ST
X2 = XTAL: Crystal Oscillator; Fitted: NO; Published: 8-Jun-2000; LatestRevisionDate: 17-Jul-2002; LatestRevisionNote: Re-released for DXP Platform.; PackageReference: R38; Publisher: Altium Limited
X3 = MC306: Fitted: NO

## Nets that join several sheets
3V: MB1035 (P1.1 P1.2), ST_LINK_V2 (17 pins), IO Peripherals (12 pins)
5V: MB1035 (P2.1 P2.2), ST_LINK_V2 (5 pins), IO Peripherals (D5.2)
GND: MB1035 (5 pins), ST_LINK_V2 (36 pins), IO Peripherals (24 pins), STM32Fx (21 pins)
VDD: MB1035 (P2.20), ST_LINK_V2 (JP3.2), IO Peripherals (B1.1 B1.4 R37.2 R39.2), STM32Fx (13 pins)
BOOT0: MB1035 (P2.19), STM32Fx (R35.2 R36.2 U4.94)
MCO: ST_LINK_V2 (C38.1 R48.2), STM32Fx (SB12.1)
NRST: MB1035 (P1.4), ST_LINK_V2 (SB7.2), IO Peripherals (SB23.1), STM32Fx (U4.14)
PA0: MB1035 (P1.12), IO Peripherals (SB20.1), STM32Fx (U4.23)
PA1: MB1035 (P1.9), STM32Fx (U4.24)
PA2: MB1035 (P1.14), STM32Fx (U4.25)
PA3: MB1035 (P1.11), STM32Fx (U4.26)
PA4: MB1035 (P1.16), STM32Fx (U4.29)
PA5: MB1035 (P1.15), IO Peripherals (U5.2), STM32Fx (U4.30)
PA6: MB1035 (P1.18), IO Peripherals (U5.4), STM32Fx (U4.31)
PA7: MB1035 (P1.17), IO Peripherals (U5.3), STM32Fx (U4.32)
PA8: MB1035 (P2.45), STM32Fx (U4.67)
PA9: MB1035 (P2.44), STM32Fx (U4.68)
PA10: MB1035 (P2.43), STM32Fx (U4.69)
PA11: MB1035 (SB22.2), IO Peripherals (R18.2), STM32Fx (U4.70)
PA12: MB1035 (SB21.1), IO Peripherals (R17.2), STM32Fx (U4.71)
PA13: MB1035 (P2.40), ST_LINK_V2 (SB8.1), STM32Fx (U4.72)
PA14: MB1035 (P2.37), ST_LINK_V2 (SB3.1), STM32Fx (U4.76)
PA15: MB1035 (P2.38), STM32Fx (U4.77)
PB0: MB1035 (P1.22), STM32Fx (U4.35)
PB1: MB1035 (P1.21), STM32Fx (U4.36)
PB2: MB1035 (P1.24), STM32Fx (U4.37)
PB3: MB1035 (P2.26), ST_LINK_V2 (SB10.2), STM32Fx (U4.89)
PB4: MB1035 (P2.23), STM32Fx (U4.90)
PB5: MB1035 (P2.24), STM32Fx (U4.91)
PB6: MB1035 (P2.21), IO Peripherals (R28.2 U3.2), STM32Fx (U4.92)
PB7: MB1035 (P2.22), IO Peripherals (R27.2 U3.3), STM32Fx (U4.93)
PB8: MB1035 (P2.17), STM32Fx (U4.95)
PB9: MB1035 (P2.18), STM32Fx (U4.96)
PB10: MB1035 (P1.34), STM32Fx (U4.47)
PB11: MB1035 (P1.33), STM32Fx (U4.48)
PB12: MB1035 (P1.36), STM32Fx (U4.51)
PB13: MB1035 (P1.35), STM32Fx (U4.52)
PB14: MB1035 (P1.38), STM32Fx (U4.53)
PB15: MB1035 (P1.37), STM32Fx (U4.54)
PC0: MB1035 (P1.6), STM32Fx (U4.15)
PC1: MB1035 (P1.5), STM32Fx (U4.16)
PC2: MB1035 (P1.8), STM32Fx (U4.17)
PC3: MB1035 (P1.7), STM32Fx (U4.18)
PC4: MB1035 (P1.20), ST_LINK_V2 (SB15.1), STM32Fx (U4.33)
PC5: MB1035 (P1.19), ST_LINK_V2 (SB13.1), STM32Fx (U4.34)
PC6: MB1035 (P1.47), STM32Fx (U4.63)
PC7: MB1035 (P1.48), STM32Fx (U4.64)
PC8: MB1035 (P2.47), STM32Fx (U4.65)
PC9: MB1035 (P2.46), STM32Fx (U4.66)
PC10: MB1035 (P2.35), STM32Fx (U4.78)
PC11: MB1035 (P2.36), STM32Fx (U4.79)
PC12: MB1035 (P2.33), STM32Fx (U4.80)
PC13: MB1035 (P2.10), STM32Fx (U4.7)
PC14: MB1035 (P2.7), STM32Fx (SB14.1)
PC15: MB1035 (P2.8), STM32Fx (SB16.1)
PD0: MB1035 (P2.34), STM32Fx (U4.81)
PD1: MB1035 (P2.31), STM32Fx (U4.82)
PD2: MB1035 (P2.32), STM32Fx (U4.83)
PD3: MB1035 (P2.29), STM32Fx (U4.84)
PD4: MB1035 (P2.30), STM32Fx (U4.85)
PD5: MB1035 (P2.27), STM32Fx (U4.86)
PD6: MB1035 (P2.28), STM32Fx (U4.87)
PD7: MB1035 (P2.25), STM32Fx (U4.88)
PD8: MB1035 (P1.40), STM32Fx (U4.55)
PD9: MB1035 (P1.39), STM32Fx (U4.56)
PD10: MB1035 (P1.42), STM32Fx (U4.57)
PD11: MB1035 (P1.41), STM32Fx (U4.58)
PD12: MB1035 (P1.44), STM32Fx (U4.59)
PD13: MB1035 (P1.43), STM32Fx (U4.60)
PD14: MB1035 (P1.46), STM32Fx (U4.61)
PD15: MB1035 (P1.45), STM32Fx (U4.62)
PE0: MB1035 (P2.15), IO Peripherals (U5.7), STM32Fx (U4.97)
PE1: MB1035 (P2.16), IO Peripherals (U5.6), STM32Fx (U4.98)
PE2: MB1035 (P2.13), IO Peripherals (U3.9), STM32Fx (U4.1)
PE3: MB1035 (P2.14), IO Peripherals (U5.5), STM32Fx (U4.2)
PE4: MB1035 (P2.11), IO Peripherals (U3.5), STM32Fx (U4.3)
PE5: MB1035 (P2.12), IO Peripherals (U3.4), STM32Fx (U4.4)
PE6: MB1035 (P2.9), STM32Fx (U4.5)
PE7: MB1035 (P1.23), STM32Fx (U4.38)
PE8: MB1035 (P1.26), IO Peripherals (R40.2), STM32Fx (U4.39)
PE9: MB1035 (P1.25), IO Peripherals (R41.2), STM32Fx (U4.40)
PE10: MB1035 (P1.28), IO Peripherals (R42.2), STM32Fx (U4.41)
PE11: MB1035 (P1.27), IO Peripherals (R44.2), STM32Fx (U4.42)
PE12: MB1035 (P1.30), IO Peripherals (R47.2), STM32Fx (U4.43)
PE13: MB1035 (P1.29), IO Peripherals (R46.2), STM32Fx (U4.44)
PE14: MB1035 (P1.32), IO Peripherals (R45.2), STM32Fx (U4.45)
PE15: MB1035 (P1.31), IO Peripherals (R43.2), STM32Fx (U4.46)
PF0: MB1035 (P2.5), STM32Fx (SB17.1)
PF1: MB1035 (P2.6), STM32Fx (SB18.1)
PF2: MB1035 (P1.10), STM32Fx (U4.19)
PF4: MB1035 (P1.13), STM32Fx (U4.27)
PF6: MB1035 (P2.39), STM32Fx (U4.73)
PF9: MB1035 (P2.3), STM32Fx (U4.10)
PF10: MB1035 (P2.4), STM32Fx (U4.11)